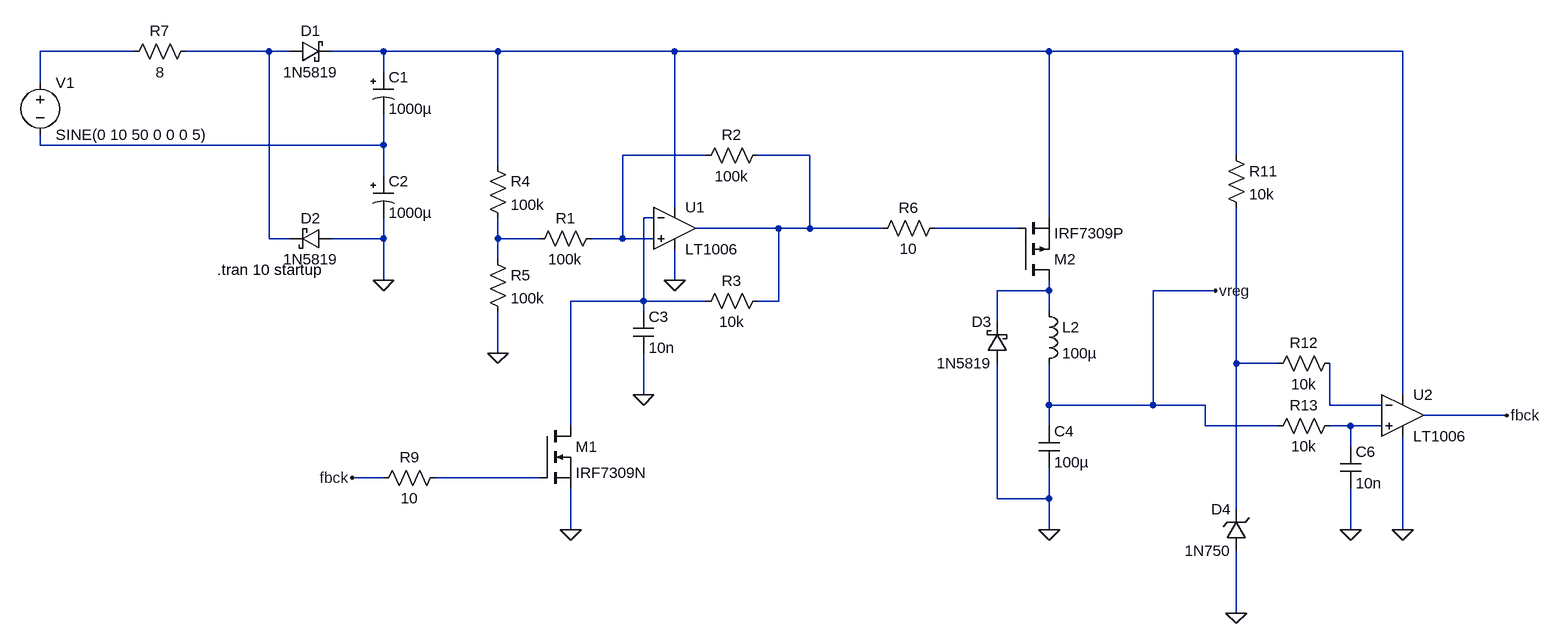
[diagram p0: schematic 2022_05_15_door_bell_power_supply.asc]
2022_05_15_door_bell_power_supply.asc, the LTspice schematic file:
Version 4
SHEET 1 3208 1268
WIRE -256 48 -400 48
WIRE -48 48 -176 48
WIRE -16 48 -48 48
WIRE 128 48 48 48
WIRE 304 48 128 48
WIRE 576 48 304 48
WIRE 1152 48 576 48
WIRE 1440 48 1152 48
WIRE 1696 48 1440 48
WIRE 128 80 128 48
WIRE -400 96 -400 48
WIRE -400 192 -400 176
WIRE 128 192 128 144
WIRE 128 192 -400 192
WIRE 624 208 496 208
WIRE 784 208 704 208
WIRE 1440 208 1440 48
WIRE 304 224 304 48
WIRE 128 240 128 192
WIRE 576 288 576 48
WIRE 544 304 528 304
WIRE 1152 304 1152 48
WIRE 736 320 608 320
WIRE 784 320 784 208
WIRE 784 320 736 320
WIRE 896 320 784 320
WIRE 1104 320 976 320
WIRE -48 336 -48 48
WIRE -16 336 -48 336
WIRE 128 336 128 304
WIRE 128 336 48 336
WIRE 304 336 304 304
WIRE 368 336 304 336
WIRE 496 336 496 208
WIRE 496 336 448 336
WIRE 544 336 496 336
WIRE 304 368 304 336
WIRE 128 400 128 336
WIRE 576 400 576 352
WIRE 1152 416 1152 400
WIRE 1152 416 1072 416
WIRE 1408 416 1312 416
WIRE 528 432 528 304
WIRE 528 432 416 432
WIRE 624 432 528 432
WIRE 736 432 736 320
WIRE 736 432 704 432
WIRE 528 448 528 432
WIRE 1152 448 1152 416
WIRE 1072 464 1072 416
WIRE 304 512 304 448
WIRE 1440 528 1440 288
WIRE 1504 528 1440 528
WIRE 528 576 528 512
WIRE 1696 576 1696 48
WIRE 1152 592 1152 528
WIRE 1312 592 1312 416
WIRE 1312 592 1152 592
WIRE 1392 592 1312 592
WIRE 1584 592 1584 528
WIRE 1664 592 1584 592
WIRE 1856 608 1728 608
WIRE 416 624 416 432
WIRE 1152 624 1152 592
WIRE 1392 624 1392 592
WIRE 1504 624 1392 624
WIRE 1616 624 1584 624
WIRE 1664 624 1616 624
WIRE 1616 656 1616 624
WIRE 128 704 80 704
WIRE 368 704 208 704
WIRE 1072 736 1072 528
WIRE 1152 736 1152 688
WIRE 1152 736 1072 736
WIRE 1440 752 1440 528
WIRE 416 784 416 720
WIRE 1152 784 1152 736
WIRE 1616 784 1616 720
WIRE 1696 784 1696 640
WIRE 1440 912 1440 816
FLAG 128 400 0
FLAG 576 400 0
FLAG 528 576 0
FLAG 304 512 0
FLAG 1152 784 0
FLAG 416 784 0
FLAG 1856 608 fbck
FLAG 80 704 fbck
FLAG 1696 784 0
FLAG 1408 416 vreg
FLAG 1616 784 0
FLAG 1440 912 0
SYMBOL polcap 112 80 R0
WINDOW 3 24 56 Left 2
SYMATTR Value 1000µ
SYMATTR InstName C1
SYMATTR Description Capacitor
SYMATTR Type cap
SYMATTR SpiceLine V=16 Irms=800m Rser=0.14 Lser=0
SYMBOL polcap 112 240 R0
WINDOW 3 24 56 Left 2
SYMATTR Value 1000µ
SYMATTR InstName C2
SYMATTR Description Capacitor
SYMATTR Type cap
SYMATTR SpiceLine V=16 Irms=800m Rser=0.14 Lser=0
SYMBOL voltage -400 80 R0
WINDOW 123 0 0 Left 0
WINDOW 39 24 124 Left 2
SYMATTR InstName V1
SYMATTR Value SINE(0 10 50 0 0 0 5)
SYMBOL schottky -16 64 R270
WINDOW 0 32 32 VTop 2
WINDOW 3 0 32 VBottom 2
SYMATTR InstName D1
SYMATTR Value 1N5819
SYMATTR Description Diode
SYMATTR Type diode
SYMBOL schottky 48 320 R90
WINDOW 0 0 32 VBottom 2
WINDOW 3 32 32 VTop 2
SYMATTR InstName D2
SYMATTR Value 1N5819
SYMATTR Description Diode
SYMATTR Type diode
SYMBOL OpAmps\\LT1006 576 256 R0
SYMATTR InstName U1
SYMBOL res 464 320 R90
WINDOW 0 0 56 VBottom 2
WINDOW 3 32 56 VTop 2
SYMATTR InstName R1
SYMATTR Value 100k
SYMBOL res 720 192 R90
WINDOW 0 0 56 VBottom 2
WINDOW 3 32 56 VTop 2
SYMATTR InstName R2
SYMATTR Value 100k
SYMBOL cap 512 448 R0
SYMATTR InstName C3
SYMATTR Value 10n
SYMBOL res 720 416 R90
WINDOW 0 0 56 VBottom 2
WINDOW 3 32 56 VTop 2
SYMATTR InstName R3
SYMATTR Value 10k
SYMBOL res 288 208 R0
SYMATTR InstName R4
SYMATTR Value 100k
SYMBOL res 288 352 R0
SYMATTR InstName R5
SYMATTR Value 100k
SYMBOL pmos 1104 400 M180
SYMATTR InstName M2
SYMATTR Value IRF7309P
SYMBOL ind 1136 432 R0
SYMATTR InstName L2
SYMATTR Value 100µ
SYMBOL cap 1136 624 R0
SYMATTR InstName C4
SYMATTR Value 100µ
SYMBOL schottky 1088 528 R180
WINDOW 0 24 64 Left 2
WINDOW 3 24 0 Left 2
SYMATTR InstName D3
SYMATTR Value 1N5819
SYMATTR Description Diode
SYMATTR Type diode
SYMBOL nmos 368 624 R0
SYMATTR InstName M1
SYMATTR Value IRF7309N
SYMBOL OpAmps\\LT1006 1696 544 R0
SYMATTR InstName U2
SYMBOL res 992 304 R90
WINDOW 0 0 56 VBottom 2
WINDOW 3 32 56 VTop 2
SYMATTR InstName R6
SYMATTR Value 10
SYMBOL res 224 688 R90
WINDOW 0 0 56 VBottom 2
WINDOW 3 32 56 VTop 2
SYMATTR InstName R9
SYMATTR Value 10
SYMBOL res 1424 192 R0
SYMATTR InstName R11
SYMATTR Value 10k
SYMBOL res 1600 512 R90
WINDOW 0 0 56 VBottom 2
WINDOW 3 32 56 VTop 2
SYMATTR InstName R12
SYMATTR Value 10k
SYMBOL res 1600 608 R90
WINDOW 0 0 56 VBottom 2
WINDOW 3 32 56 VTop 2
SYMATTR InstName R13
SYMATTR Value 10k
SYMBOL cap 1600 656 R0
SYMATTR InstName C6
SYMATTR Value 10n
SYMBOL zener 1456 816 R180
WINDOW 0 24 64 Left 2
WINDOW 3 24 0 Left 2
SYMATTR InstName D4
SYMATTR Value 1N750
SYMBOL res -160 32 R90
WINDOW 0 0 56 VBottom 2
WINDOW 3 32 56 VTop 2
SYMATTR InstName R7
SYMATTR Value 8
TEXT -128 384 Left 2 !.tran 10 startup

The netlist it stands for:
* 2022_05_15_door_bell_power_supply.asc
C1 N003 N004 1000µ V=16 Irms=800m Rser=0.14 Lser=0
C2 N004 0 1000µ V=16 Irms=800m Rser=0.14 Lser=0
V1 N001 N004 SINE(0 10 50 0 0 0 5)
D1 N002 N003 1N5819
D2 0 N002 1N5819
XU1 N005 N007 N003 0 N006 LT1006  ; pins In+ In- V+ V- OUT
R1 N005 N009 100k
R2 N006 N005 100k
C3 N007 0 10n
R3 N006 N007 10k
R4 N003 N009 100k
R5 N009 0 100k
M2 N010 N008 N003 N003 IRF7309P
L2 N010 vreg 100µ
C4 vreg 0 100µ
D3 0 N010 1N5819
M1 N007 N014 0 0 IRF7309N
XU2 N013 N012 N003 0 fbck LT1006  ; pins In+ In- V+ V- OUT
R6 N008 N006 10
R9 N014 fbck 10
R11 N003 N011 10k
R12 N012 N011 10k
R13 N013 vreg 10k
C6 N013 0 10n
D4 0 N011 1N750
R7 N002 N001 8
.model D D
.lib standard.dio
.model NMOS NMOS
.model PMOS PMOS
.lib standard.mos
.tran 10 startup
.lib LTC.lib
.backanno
.end